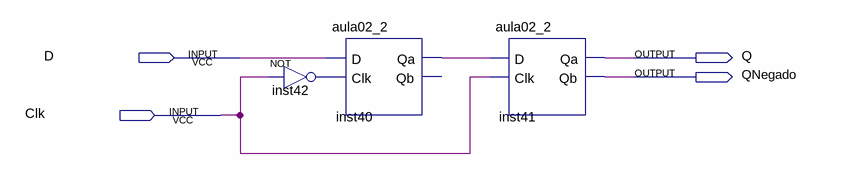
[diagram p0: schematic sheet]
// Quartus schematic aula02_3.bdf as structural Verilog: 3 symbols, 4 pins
module aula02_3 (
  input  D,
  input  Clk,
  output Q,
  output QNegado
);

  wire inst40_qa, inst42_out;

  not inst42 (inst42_out, Clk);
  aula02_2 inst40 (.D(D), .Clk(inst42_out), .Qa(inst40_qa));  // open: Qb
  aula02_2 inst41 (.D(inst40_qa), .Clk(Clk), .Qa(Q), .Qb(QNegado));
endmodule
